# Altium schematic sheet TopSheet.SchDoc
size 431 x 279 mm; Date: Not shown in title block; ApprovedBy: Not shown in title block; CheckedBy: Not shown in title block; Author: Not shown in title block; CompanyName: Not shown in title block; Engineer: Not shown in title block; Organization: Not shown in title block; Address1: Not shown in title block; Address2: Not shown in title block; Address3: Not shown in title block; Address4: Not shown in title block; DocumentNumber: 6; Revision: Use project parameter SCH_Rev; SheetNumber: 6; SheetTotal: 6; PageSetup: Record=PageOptions|CenterHorizontal=True|CenterVertical=True|PrintScale=1.00|XCorrection=1.00|YCorrection=1.00|PrintKind=0|BorderSize=5000000|LeftOffset=0|BottomOffset=0|Orientation=2|PaperLength=1000|PaperWidth=1000|Scale=100|PaperSource=15|PrintQuality=600|MediaType=1|DitherType=10|PaperKind=Letter|PrintScaleMode=1; CurrentTime: Not shown in title block; CurrentDate: Not shown in title block; Time: Not shown in title block; DocumentFullPathAndName: Not shown in title block; DocumentName: Not shown in title block; ModifiedDate: Not shown in title block; ImagePath: Not shown in title block
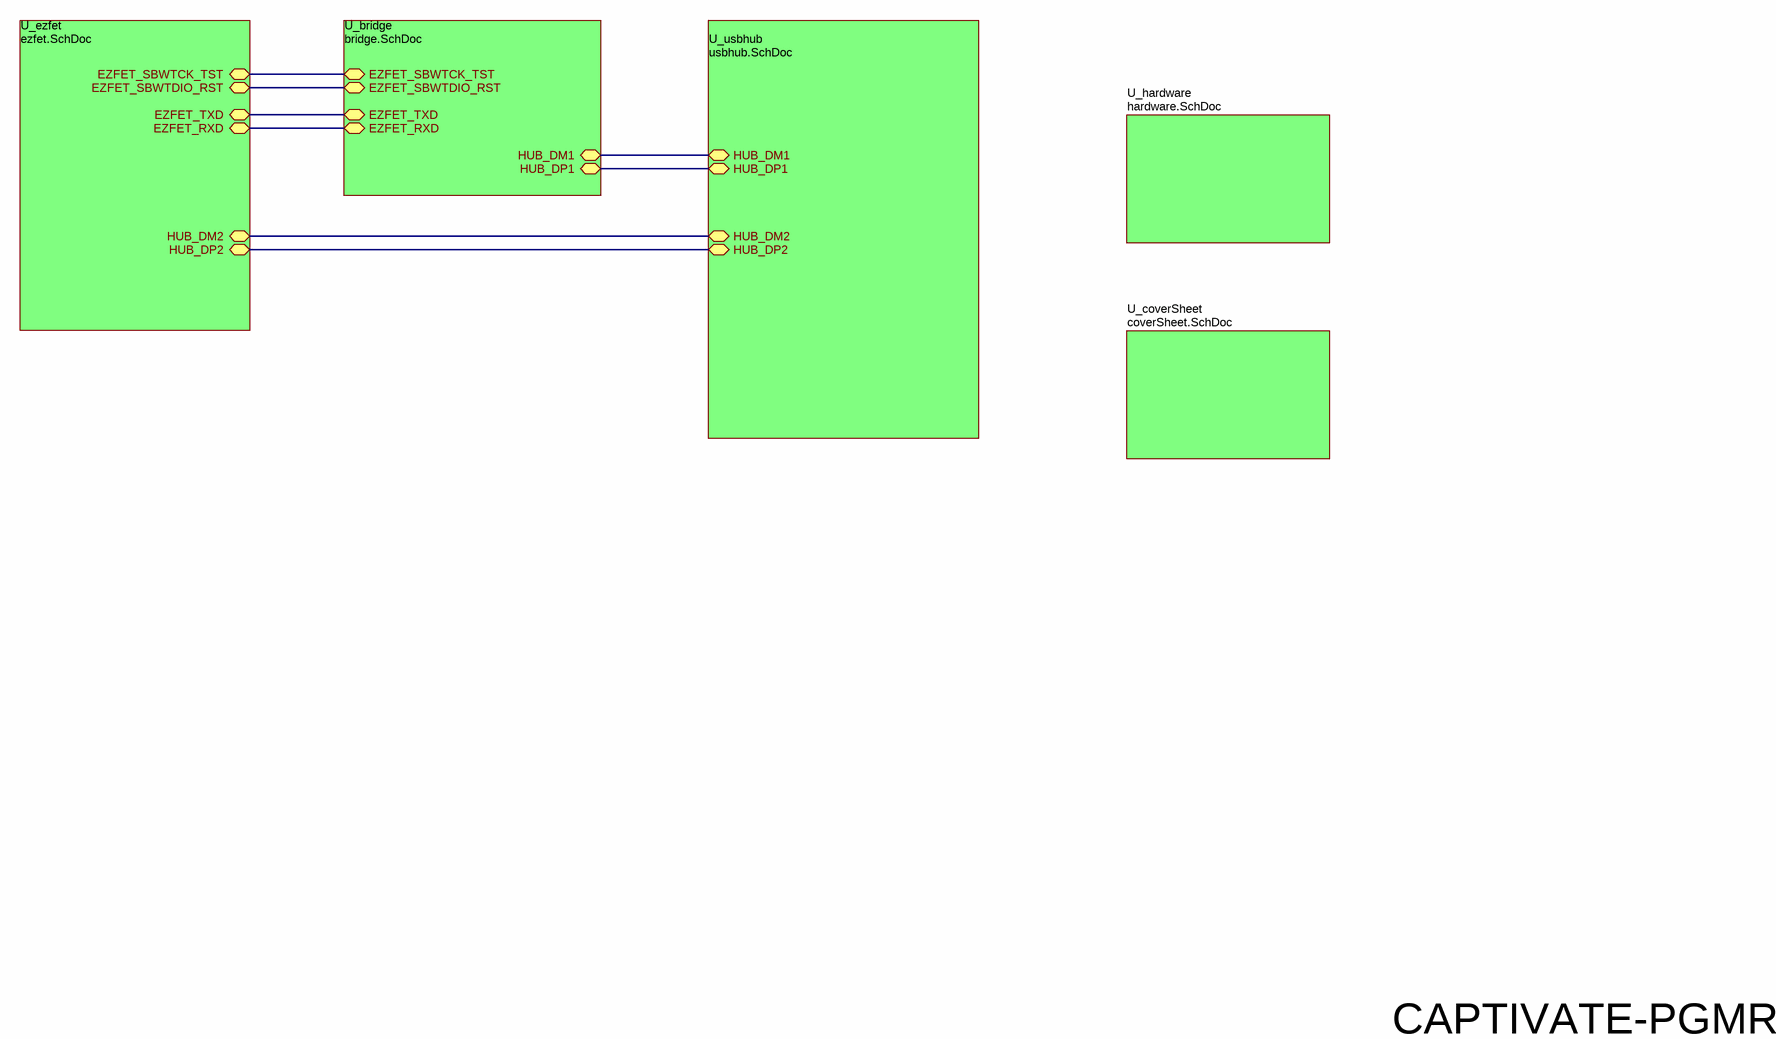
[diagram p0: TopSheet.SchDoc]

## Sub-sheets
U_bridge = bridge.SchDoc: EZFET_SBWTCK_TST, EZFET_SBWTDIO_RST, EZFET_TXD (bidir), EZFET_RXD (bidir), HUB_DM1 (bidir), HUB_DP1 (bidir)
U_coverSheet = coverSheet.SchDoc: no entries
U_ezfet = ezfet.SchDoc: EZFET_SBWTDIO_RST, EZFET_SBWTCK_TST, EZFET_TXD (bidir), EZFET_RXD (bidir), HUB_DM2 (bidir), HUB_DP2 (bidir)
U_hardware = hardware.SchDoc: no entries
U_usbhub = usbhub.SchDoc: HUB_DM2 (bidir), HUB_DP2 (bidir), HUB_DM1 (bidir), HUB_DP1 (bidir)

## Nets
(unnamed): sheet U_usbhub/HUB_DM2, sheet U_ezfet/HUB_DM2
(unnamed): sheet U_usbhub/HUB_DP2, sheet U_ezfet/HUB_DP2
(unnamed): sheet U_usbhub/HUB_DM1, sheet U_bridge/HUB_DM1
(unnamed): sheet U_usbhub/HUB_DP1, sheet U_bridge/HUB_DP1
(unnamed): sheet U_ezfet/EZFET_SBWTDIO_RST, sheet U_bridge/EZFET_SBWTDIO_RST
(unnamed): sheet U_ezfet/EZFET_SBWTCK_TST, sheet U_bridge/EZFET_SBWTCK_TST
(unnamed): sheet U_ezfet/EZFET_TXD, sheet U_bridge/EZFET_TXD
(unnamed): sheet U_ezfet/EZFET_RXD, sheet U_bridge/EZFET_RXD

## Notes on the sheet
- CAPTIVATE-PGMR
- Drawn By:
- SVN Rev:
- Number:
- TID #:
- Orderable:
- Rev:
- Sheet Title:
- File:
- Project Title:
- Designed for:
- Assembly Variant:
- Mod. Date:
- Sheet:
- Size:
- of
- B
- http://www.ti.com
- Texas Instruments and/or its licensors do not warrant the accuracy or completeness of this specification or any information contained therein. Texas Instruments and/or its licensors do not warrant that this design will meet the specifications, will be suitable for your application or fit for any particular purpose, or will operate in an implementation. Texas Instruments and/or its licensors do not warrant that the design is production worthy. You should completely validate and test your design implementation to confirm the system functionality for your application.
- Engineer:
- Contact:
- © Texas Instruments